# Altium schematic sheet STM32F030F4P6_dev_board.SchDoc
size A; SheetNumber: 1; SheetTotal: 1
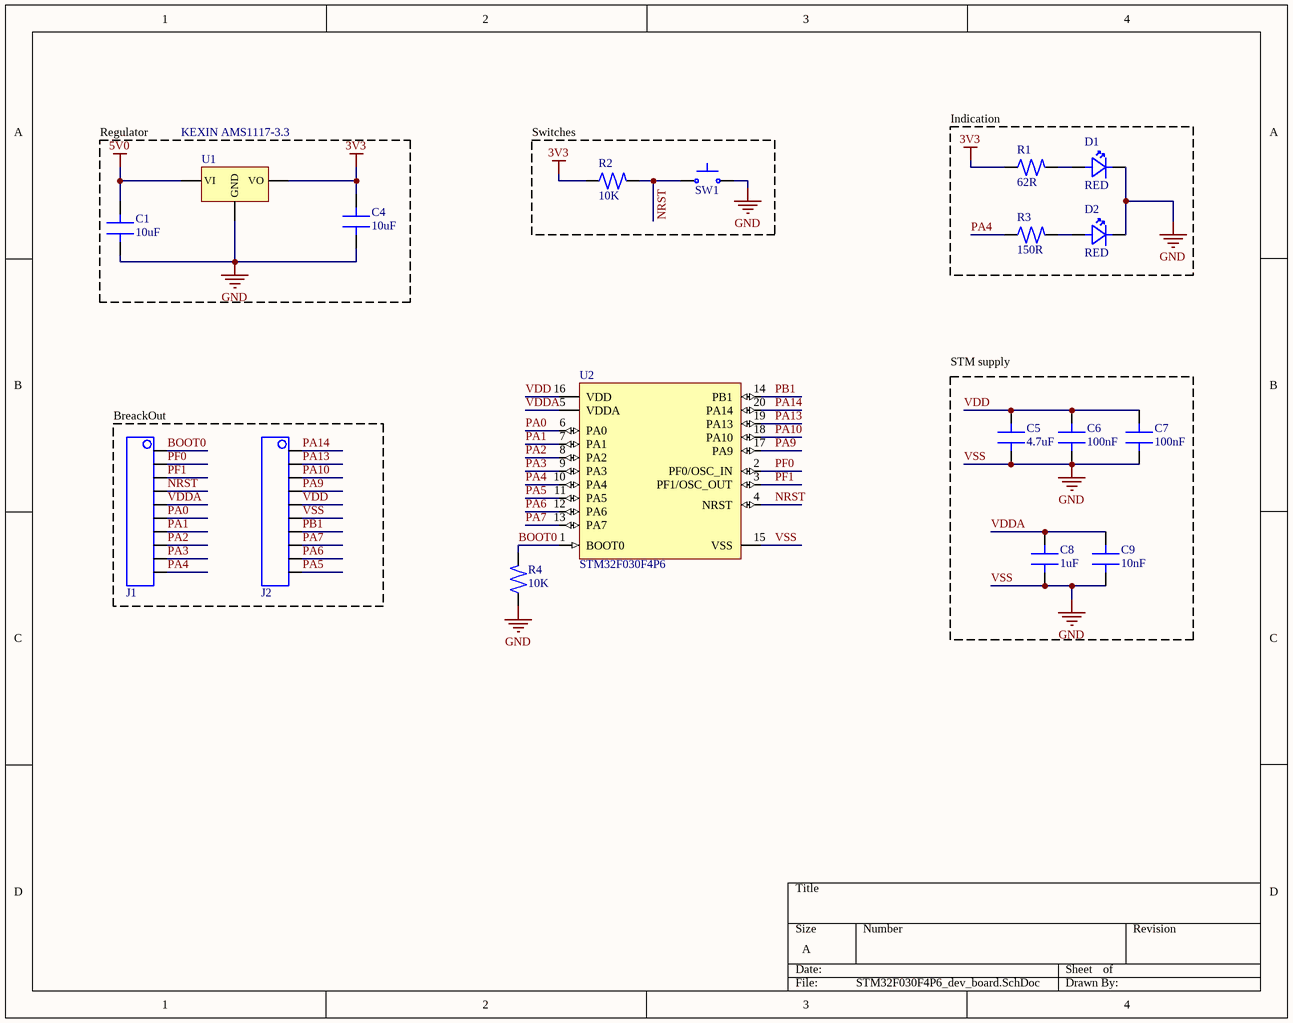
[diagram p0: STM32F030F4P6_dev_board.SchDoc]

## Parts
C1  10uF  [Ceramic Capacitor 0603]
C4  10uF  [Ceramic Capacitor 0603]
C5  4.7uF  [Ceramic Capacitor 0603]
C6  100nF  [Ceramic Capacitor 0603]
C7  100nF  [Ceramic Capacitor 0603]
C8  1uF  [Ceramic Capacitor 0603]
C9  10nF  [Ceramic Capacitor 0603]
D1  RED  [LED 0805 SMD]
D2  RED  [LED 0805 SMD]
J1  Pin header 10pin  [Pin header 10pin]  (value not drawn)
J2  Pin header 10pin  [Pin header 10pin]  (value not drawn)
R1  62R  [Resistor 0603 SMD]
R2  10K  [Resistor 0603 SMD]
R3  150R  [Resistor 0603 SMD]
R4  10K  [Resistor 0603 SMD]
SW1  XKB Connectivity TS-1101-C-W  [XKB Connectivity TS-1101-C-W]  (value not drawn)
U1  KEXIN AMS1117-3.3  [KEXIN AMS1117-3.3]
U2  STM32F030F4P6  [STM32F030F4P6-TSSOP20]

## Blocks framed on the sheet
Regulator: C1 C4 U1
Switches: R2 SW1
Indication: D1 D2 R1 R3
STM supply: C5-C9
BreackOut: J1 J2

## Nets
3V3: C4.2 R1.1 R2.1 U1.VO
5V0: C1.2 U1.VI
VSS: C1.1 C4.1 C5.2 C6.1 C7.1 C8.1 C9.2 D1.C D2.C J2.6 R4.1 SW1.2 U1.GND U2.15(VSS)  [also labelled GND]
BOOT0: J1.1 R4.2 U2.1(BOOT0)
NRST: J1.4 R2.2 SW1.1 U2.4(NRST)
PA0: J1.6 U2.6(PA0)
PA1: J1.7 U2.7(PA1)
PA2: J1.8 U2.8(PA2)
PA3: J1.9 U2.9(PA3)
PA4: J1.10 R3.1 U2.10(PA4)
PA5: J2.10 U2.11(PA5)
PA6: J2.9 U2.12(PA6)
PA7: J2.8 U2.13(PA7)
PA9: J2.4 U2.17(PA9)
PA10: J2.3 U2.18(PA10)
PA13: J2.2 U2.19(PA13)
PA14: J2.1 U2.20(PA14)
PB1: J2.7 U2.14(PB1)
PF0: J1.2 U2.2(PF0/OSC_IN)
PF1: J1.3 U2.3(PF1/OSC_OUT)
VDD: C5.1 C6.2 C7.2 J2.5 U2.16(VDD)
VDDA: C8.2 C9.1 J1.5 U2.5(VDDA)
NetD1_A: D1.A R1.2
NetD2_A: D2.A R3.2

## Notes on the sheet
- (near D2) Additional Led for PA4 for testing
- Connected to pull down resistor to boot from main memory

## Library data of the parts
C1 C4 = Ceramic Capacitor 0603 10uF: 16V 10uF X5R ±20% 0603 Multilayer Ceramic Capacitors MLCC - SMD/SMT ROHS; Manufacturer: YAGEO; Manufacturer Part Number: CC0603MRX5R7BB106; Supplier: LCSC; Supplier Part Number: C109457
C5 = Ceramic Capacitor 0603 4.7uF: X7R 4.7nF 16V ±10% 0603 Multilayer Ceramic Capacitors MLCC - SMD/SMT ROHS; Manufacturer: YAGEO; Manufacturer Part Number: CC0603KRX7R7BB472; Supplier: LCSC; Supplier Part Number: C519419
C6 C7 = Ceramic Capacitor 0603 100nF: X7R 100nF 16V ±10% 0603 Multilayer Ceramic Capacitors MLCC - SMD/SMT ROHS; Manufacturer: YAGEO; Manufacturer Part Number: CC0603KRX7R7BB104; Supplier: LCSC; Supplier Part Number: C108079
C8 = Ceramic Capacitor 0603 1uF: X7R 1uF 16V ±10% 0603 Multilayer Ceramic Capacitors MLCC - SMD/SMT ROHS; Manufacturer: YAGEO; Manufacturer Part Number: CC0603KRX7R7BB105; Supplier: LCSC; Supplier Part Number: C106248
C9 = Ceramic Capacitor 0603 10nF: 50V 10nF X7R ±10% 0603 Multilayer Ceramic Capacitors MLCC - SMD/SMT ROHS; Manufacturer: YAGEO; Manufacturer Part Number: CC0603KRX7R9BB103; Supplier: LCSC; Supplier Part Number: C100042
D1 D2 = LED 0805 SMD: Manufacturer: Foshan NationStar Optoelectronics; Manufacturer Part Number: NCD0805R1; Supplier: LCSC; Supplier Part Number: C84256
J1 J2 = Pin header 10pin: Gold 250V 3A Straight Square Pins 2.5mm 10P 260℃ 6mm -40℃~+105℃ 3mm 2.54mm Plugin Black Brass 1x10P Plugin,P=2.54mm Pin Headers ROHS; Manufacturer: XKB Connectivity; Manufacturer Part Number: X6511WV-10H-C60D30; Supplier: LCSC; Supplier Part Number: C706882
R1 = Resistor 0603 62R SMD: 100mW Thick Film Resistors ±100ppm/℃ ±1% 62Ω 0603 Chip Resistor - Surface Mount ROHS; Manufacturer: YAGEO; Manufacturer Part Number: RC0603FR-0762RL; Supplier: LCSC; Supplier Part Number: C245989
R2 R4 = Resistor 0603 10K SMD: 100mW Thin Film Resistor ±25ppm/℃ ±0.1% 10kΩ 0603 Chip Resistor - Surface Mount ROHS; Manufacturer: YAGEO; Manufacturer Part Number: RT0603BRD0710KL; Supplier: LCSC; Supplier Part Number: C95204
R3 = Resistor 0603 150R SMD: 100mW Thick Film Resistors ±100ppm/℃ ±1% 150Ω 0603 Chip Resistor - Surface Mount ROHS; Manufacturer: YAGEO; Manufacturer Part Number: RC0603FR-07150RL; Supplier: LCSC; Supplier Part Number: C114608
U1 = KEXIN AMS1117-3.3: 1A Fixed 3.3V Positive 18V SOT-223-4 Linear Voltage Regulators (LDO) ROHS; Manufacturer: KENIX; Manufacturer Part Number: AMS1117-3.3; Supplier: LCSC; Supplier Part Number: C369933
U2 = STM32F030F4P6: Manufacturer: STMicroelectronics; Manufacturer Part Number: STM32F030F4P6; Supplier: LCSC; Supplier Part Number: C32908
SW1 = XKB Connectivity TS-1101-C-W: Manufacturer: XKB Connectivity; Manufacturer Part Number: TS-1101-C-W; Supplier: LCSC; Supplier Part Number: C318938